# EAGLE design fire alarm (EAGLE 7.4.0)
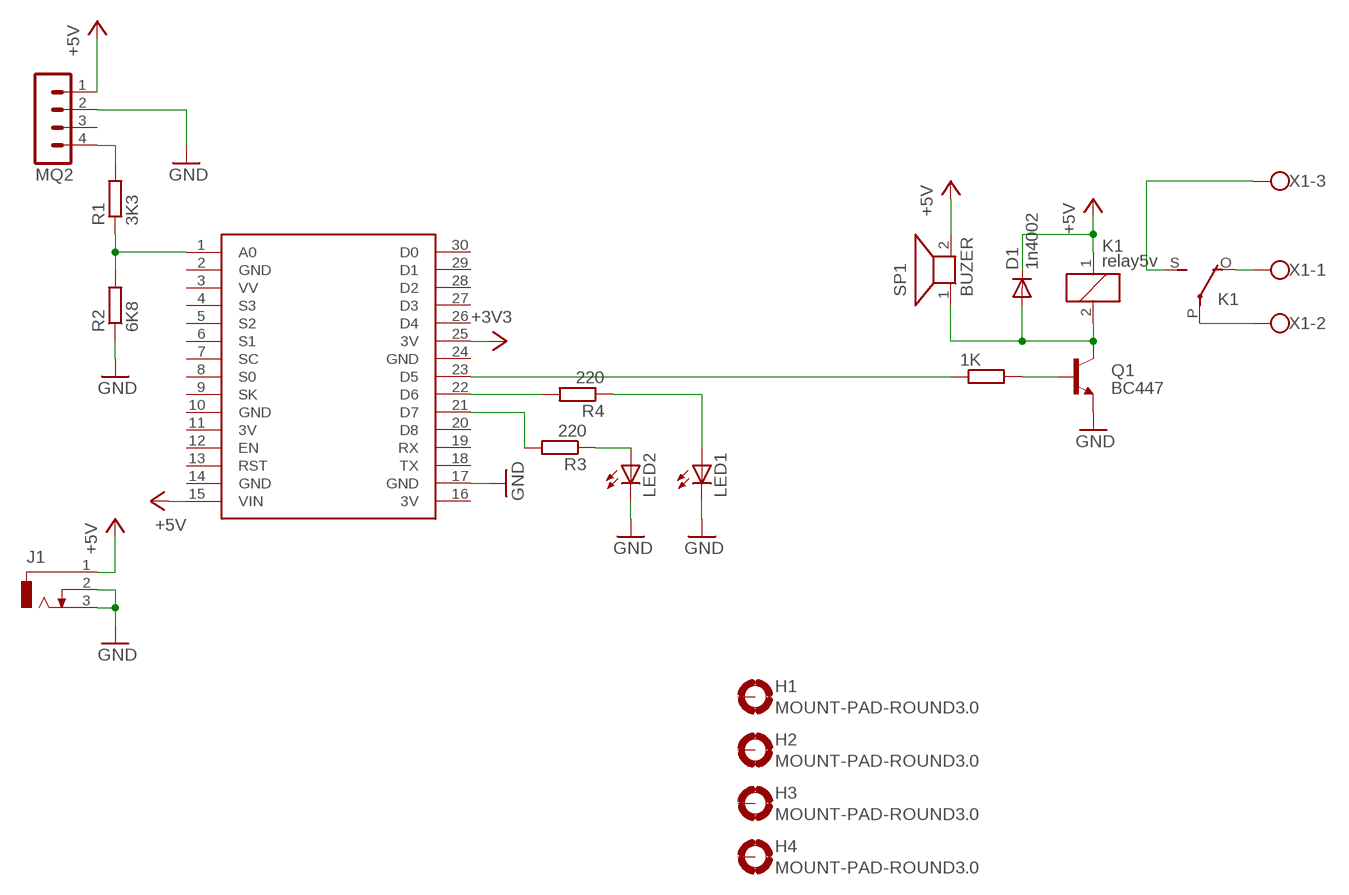
[diagram p0: schematic, sheet 1]

## Parts
1K  R-EU_0207/10  [0207/10]
D1  1n4002  1N4446  [DO35-10]
H1  MOUNT-PAD-ROUND3.0  [3,0-PAD]
H2  MOUNT-PAD-ROUND3.0  [3,0-PAD]
H3  MOUNT-PAD-ROUND3.0  [3,0-PAD]
H4  MOUNT-PAD-ROUND3.0  [3,0-PAD]
J1  DCJ0303  [DCJ0303]
K1  relay5v  ZF112  [ZF112]
LED1  LED5MM  [LED5MM]
LED2  LED5MM  [LED5MM]
MQ2  MA04-1  [MA04-1]
Q1  BC447  [TO92-EBC]
R1  3K3  R-EU_0207/10  [0207/10]
R2  6K8  R-EU_0207/10  [0207/10]
R3  220  R-EU_0207/10  [0207/10]
R4  220  R-EU_0207/10  [0207/10]
SP1  BUZER  AL60P  [AL60P]
U$2  NODEMCU  [NODEMCU]
X1  W237-103  [W237-103]

## Nets
+3V3: U$2.25(3V)
+5V: D1.C J1.1 K1.1 MQ2.1 SP1.2 U$2.15(VIN)
GND: J1.2 J1.3 LED1.K(C) LED2.K(C) MQ2.2 Q1.E R2.1 U$2.17(GND)
N$2: 1K.1 U$2.23(D5)
N$3: R1.1 R2.2 U$2.1(A0)
N$4: MQ2.4 R1.2
N$5: LED2.A R3.1
N$6: LED1.A R4.1
N$7: R4.2 U$2.22(D6)
N$8: R3.2 U$2.21(D7)
N$13: K1.S(2:S) X1.3
N$14: D1.A K1.2 Q1.C SP1.1
N$15: 1K.2 Q1.B
N$20: K1.P(2:P) X1.2
N$21: K1.O(2:O) X1.1
Unconnected: H1.B3,0(MOUNT) H2.B3,0(MOUNT) H3.B3,0(MOUNT) H4.B3,0(MOUNT) MQ2.3 U$2.3(VV) U$2.4(S3) U$2.5(S2) U$2.6(S1) U$2.7(SC) U$2.8(S0) U$2.9(SK) U$2.12(EN) U$2.13(RST) U$2.18(TX) U$2.19(RX) U$2.20(D8) U$2.26(D4) U$2.27(D3) U$2.28(D2) U$2.29(D1) U$2.30(D0)

## Power pins joined to a net without a drawn wire
3V: U$2.11(3V) U$2.16(3V)
GND: U$2.2(GND) U$2.10(GND) U$2.14(GND) U$2.24(GND)

## Library data of the parts
1K R1-R4 = rcl:R-EU_: RESISTOR, European symbol
D1 = diode:1N4446: DIODE high speed (Philips)
H1-H4 = holes:MOUNT-PAD-ROUND: MOUNTING PAD, round
J1 = con-jack:DCJ0303: DC POWER JACK Source: DCJ0303.pdf; OC_FARNELL: unknown; OC_NEWARK: unknown
K1 = relay:ZF112: RELAY 1 x switch; OC_FARNELL: unknown; OC_NEWARK: unknown
LED1 LED2 = led:LED: LED OSRAM: - CHIPLED LG R971, LG N971, LY N971, LG Q971, LY Q971, LO R971, LY R971 LH N974, LH R974 LS Q976, LO Q976, LY Q976 LO Q996 - Hyper CHIPLED LW Q18S LB Q993, LB Q99A, LB R99A - SideLED LS A670, LO A670, LY A670, LG A670, LP A670 LB A673, LV A673, LT A673, LW A673 LH A674 LY A675 LS A676, LA A676, LO A676, LY A676, LW A676 LS A679, LY A679, LG A679 - Hyper Micro SIDELED® LS Y876, LA Y876, LO Y876, LY Y876 LT Y87S - SmartLED LW L88C, LW L88S LB L89C, LB L89S, LG L890 LS L89K, LO L89K, LY L89K LS L896, LA L896, LO L896, LY L896 - TOPLED LS T670, LO T670, LY T670, LG T670, LP T670 LSG T670, LSP T670, LSY T670, LOP T670, LYG T670 LG T671, LOG T671, LSG T671 LB T673, LV T673, LT T673, LW T673 LH T674 LS T676, LA T676, LO T676, LY T676, LB T676, LH T676, LSB T676, LW T676 LB T67C, LV T67C, LT T67C, LS T67K, LO T67K, LY T67K, LW E67C LS E67B, LA E67B, LO E67B, LY E67B, LB E67C, LV E67C, LT E67C LW T67C LS T679, LY T679, LG T679 LS T770, LO T770, LY T770, LG T770, LP T770 LB T773, LV T773, LT T773, LW T773 LH T774 LS E675, LA E675, LY E675, LS T675 LS T776, LA T776, LO T776, LY T776, LB T776 LHGB T686 LT T68C, LB T68C - Hyper Mini TOPLED® LB M676 - Mini TOPLED Santana® LG M470 LS M47K, LO M47K, LY M47K Source: http://www.osram.convergy.de LUXEON: - LUMILED® LXK2-PW12-R00, LXK2-PW12-S00, LXK2-PW14-U00, LXK2-PW14-V00 LXK2-PM12-R00, LXK2-PM12-S00, LXK2-PM14-U00 LXK2-PE12-Q00, LXK2-PE12-R00, LXK2-PE12-S00, LXK2-PE14-T00, LXK2-PE14-U00 LXK2-PB12-K00, LXK2-PB12-L00, LXK2-PB12-M00, LXK2-PB14-N00, LXK2-PB14-P00, LXK2-PB14-Q00 LXK2-PR12-L00, LXK2-PR12-M00, LXK2-PR14-Q00, LXK2-PR14-R00 LXK2-PD12-Q00, LXK2-PD12-R00, LXK2-PD12-S00 LXK2-PH12-R00, LXK2-PH12-S00 LXK2-PL12-P00, LXK2-PL12-Q00, LXK2-PL12-R00 Source: www.luxeon.com KINGBRIGHT: KA-3528ASYC Source: www.kingbright.com
MQ2 = con-lstb:MA04-1: PIN HEADER; OC_FARNELL: unknown; OC_NEWARK: unknown
Q1 = transistor-npn:BC447*: NPN Transistor
SP1 = buzzer:AL60P: SPEAKER Source: Buerklin; OC_FARNELL: unknown; OC_NEWARK: unknown
U$2 = nodemcu:NODEMCU
X1 = con-wago-500:W237-103: WAGO SCREW CLAMP; MPN: 237-103; OC_FARNELL: unknown; OC_NEWARK: 18M7116

## Board
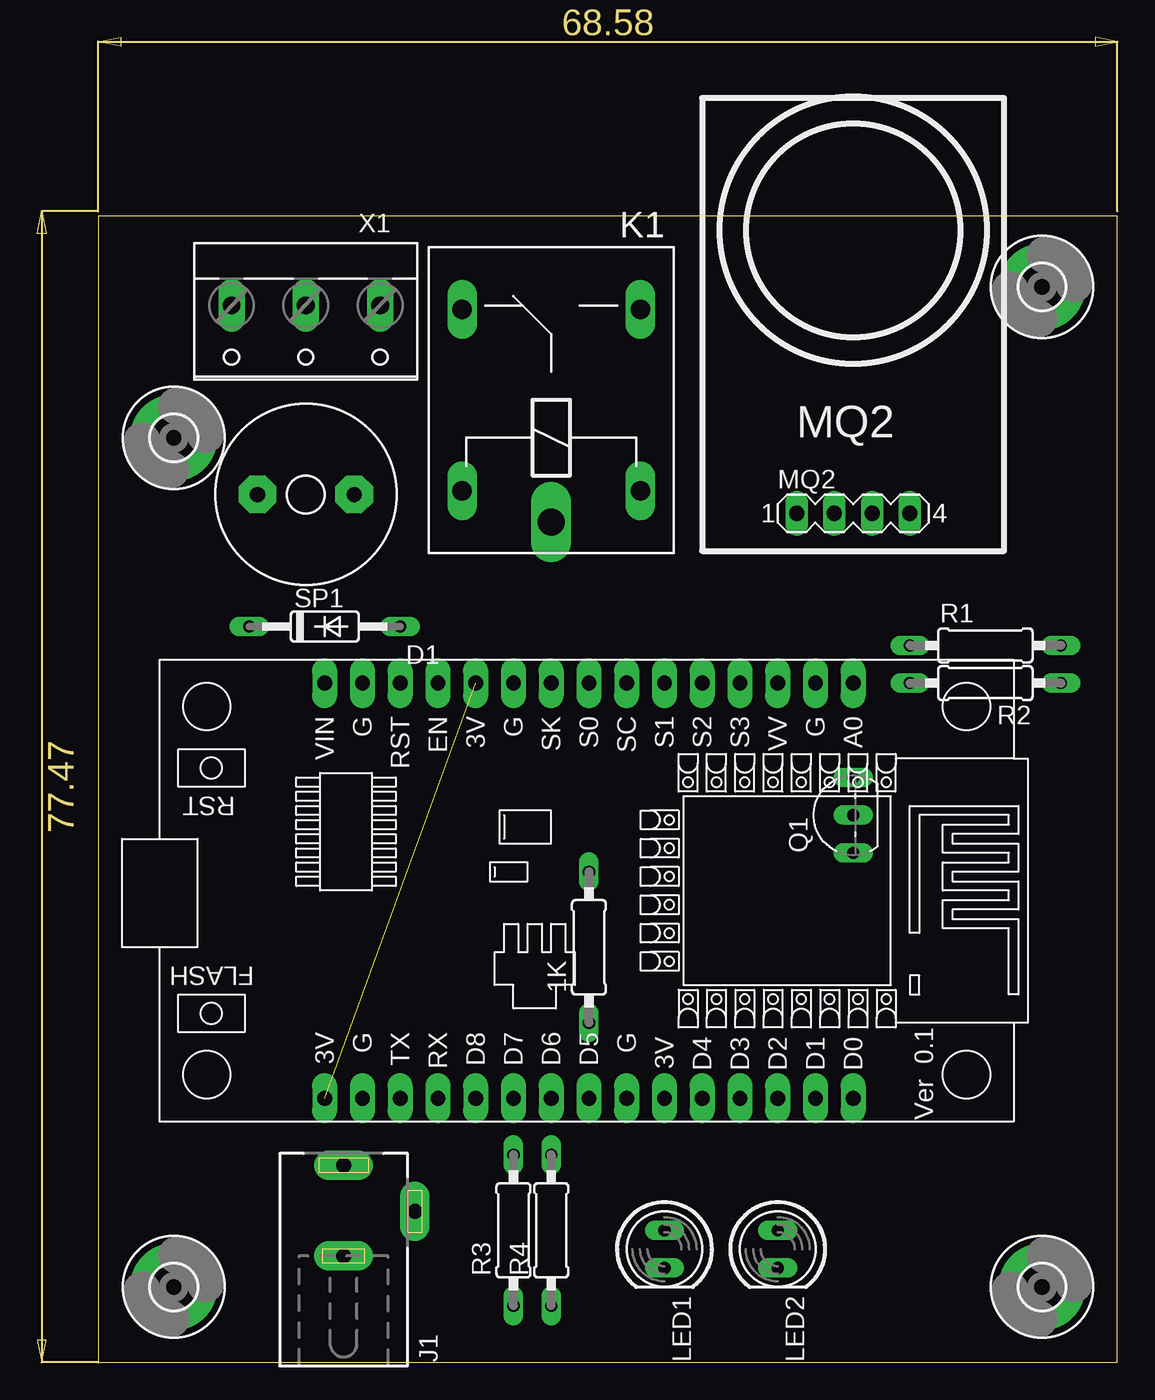
[diagram p1: board, top side]
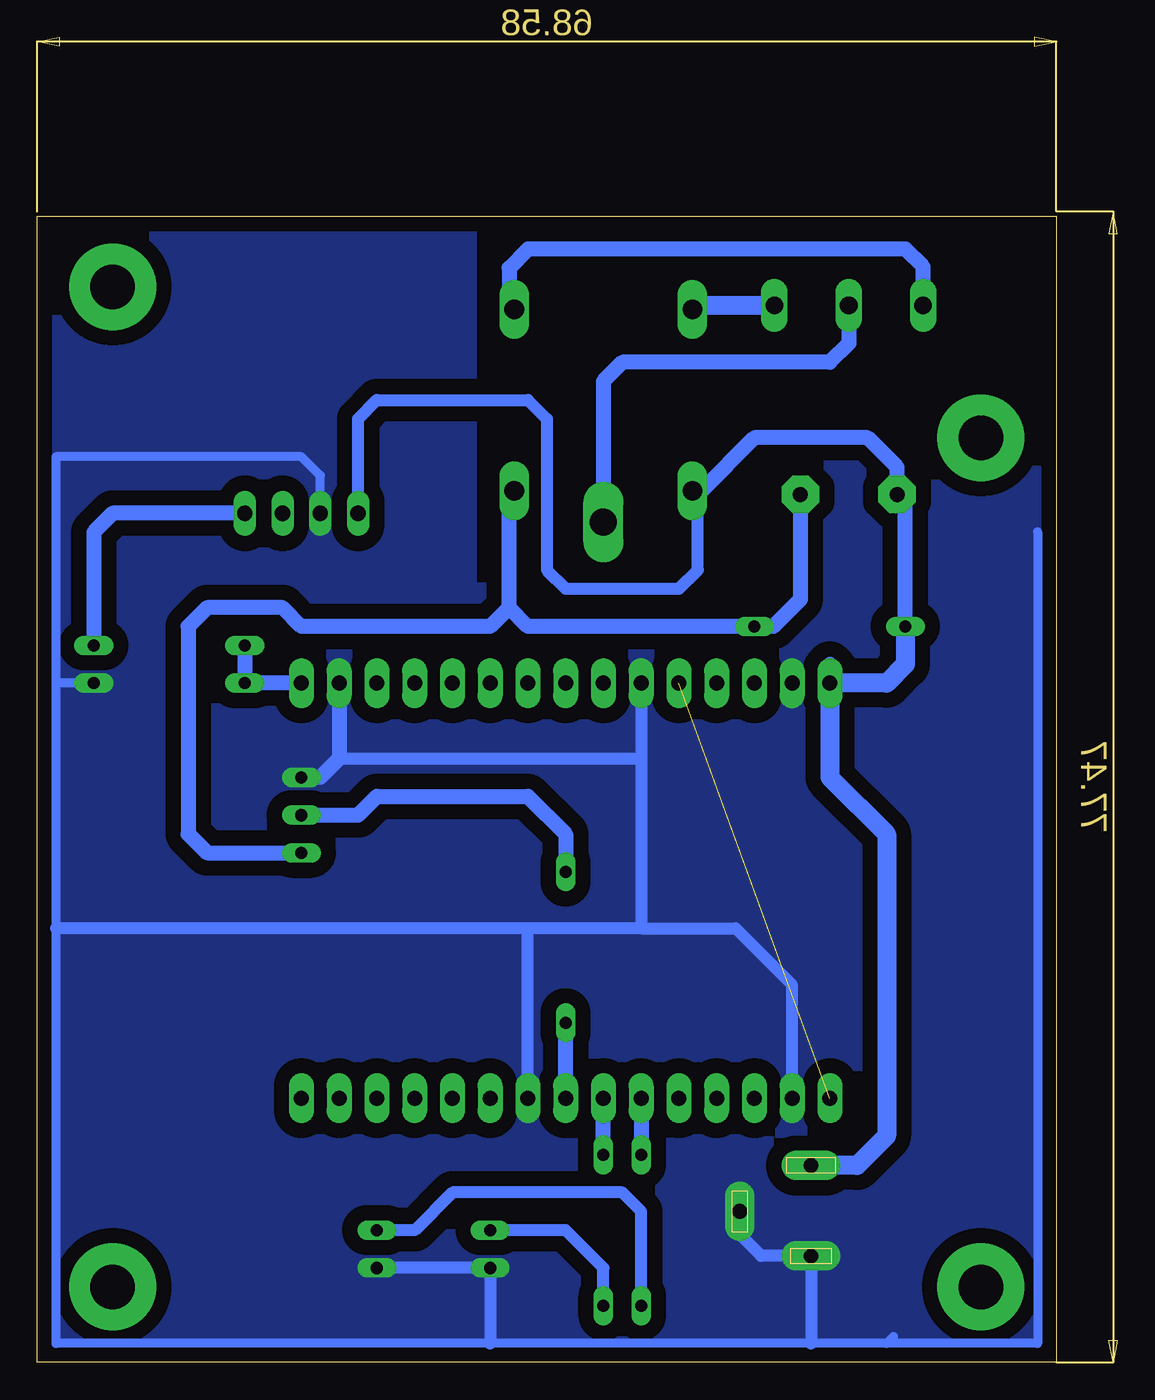
[diagram p2: board, bottom side, seen from below]

Size 68.56 x 77.14 mm. Coordinates in mm from the lower left corner, seen from the top.
Outline: 0,0 68.56,0 68.56,77.14 0,77.14 0,0
Copper layers (1*16): Top 0.035mm / dielectric 1.5mm / Bottom 0.035mm
Design rules "default": minimum track width 10mil, minimum drill 24mil, track to track 8mil, track to pad 8mil, pad to pad 8mil, via to via 8mil, smd to smd 8mil, copper to edge 40mil, drill to drill 8mil, minimum pad ring 10mil, minimum via ring 8mil, stop-mask expansion 4mil, vias tented up to drill 0mil, thermal gap 10mil

### Footprints (pad centres in the part's own frame; a part is rotated, then mirrored left to right if it is on the bottom)
0207/10 = drill 0.813 long: 1 -5.08,0; 2 5.08,0
DO35-10 = drill 0.813 long: A 5.08,0; C -5.08,0
3,0-PAD = drill 3 pad 5.842: B3,0 0,0
DCJ0303 = drill 1 pad 2 long: 1 0,3.1; 2 4.8,0; 3 0,-3
ZF112 = drill 1.321 long: 1 -6.096,5.994; 2 -6.096,-5.994; O 6.096,5.994; S 6.096,-5.994 | drill 1.803 long: P -8.204,0
LED5MM = drill 0.813 long: A -1.27,0; K 1.27,0
MA04-1 = drill 1.016 long: 1 -3.81,0; 2 -1.27,0; 3 1.27,0; 4 3.81,0
TO92-EBC = drill 0.813 long: B 0,-1.27; C -2.54,-1.27; E 2.54,-1.27
AL60P = drill 1.016 pad 2.54 octagon: 1 -3.251,0; 2 3.251,0
NODEMCU = drill 1 pad 1.676 long: 1 -13.97,17.78; 2 -13.97,15.24; 3 -13.97,12.7; 4 -13.97,10.16; 5 -13.97,7.62; 6 -13.97,5.08; 7 -13.97,2.54; 8 -13.97,0; 9 -13.97,-2.54; 10 -13.97,-5.08; 11 -13.97,-7.62; 12 -13.97,-10.16; 13 -13.97,-12.7; 14 -13.97,-15.24; 15 -13.97,-17.78; 16 13.97,-17.78; 17 13.97,-15.24; 18 13.97,-12.7; 19 13.97,-10.16; 20 13.97,-7.62; 21 13.97,-5.08; 22 13.97,-2.54; 23 13.97,0; 24 13.97,2.54; 25 13.97,5.08; 26 13.97,7.62; 27 13.97,10.16; 28 13.97,12.7; 29 13.97,15.24; 30 13.97,17.78
W237-103 = drill 1.194 long: 1 -5,-1.29; 2 0,-1.29; 3 5,-1.29

### Placement (x,y rotation side)
1K  33.02,27.94 90 top
D1  15.24,49.53 0 top
H1  63.5,5.08 0 top
H2  63.5,72.39 0 top
H3  5.08,5.08 0 top
H4  5.08,62.23 0 top
J1  16.51,10.16 0 top
K1  30.48,64.77 90 top
LED1  38.1,7.62 270 top
LED2  45.72,7.62 270 top
MQ2  50.8,57.15 0 top
Q1  49.53,36.83 90 top
R1  59.69,48.26 0 top
R2  59.69,45.72 180 top
R3  27.94,8.89 90 top
R4  30.48,8.89 90 top
SP1  13.97,58.42 180 top
U$2  33.02,31.75 270 top
X1  13.97,69.85 180 top

### Tracks (layer width: path | path; a pad name or v marks a point on that pad's centre or on a via)
3V  (1 unrouted)
+5V
  Bottom 0.813: MQ2.1 46.99,63.5 45.72,64.77 35.56,64.77 34.29,63.5 34.29,53.34 33.02,52.07 25.4,52.07 24.13,53.34 24.13,58.32 K1.1
  Bottom 1.016: U$2.15 15.24,46.99 | D1.C 10.16,57.86 SP1.2 10.72,60.25 12.7,62.23 20.32,62.23 23.88,58.67 K1.1
  Bottom 1.27: J1.1 13.41,13.26 11.43,15.24 11.43,35.56 15.24,39.37 U$2.15 11.43,45.72 10.16,46.99 D1.C
GND
  Bottom 0.61: 1.27,55.9 1.27,1.27 11.43,1.27 | 11.43,1.27 16.51,1.27 38.1,1.27 67.31,1.27 67.31,29.21 67.31,45.72 | 67.31,45.72 67.31,60.96 50.8,60.96 49.53,59.69 MQ2.2 | R2.1 67.31,45.72 | 10.97,1.73 11.43,1.27
  Bottom 0.813: U$2.10 27.94,40.64 | 48.26,40.64 27.94,40.64 | 27.94,40.64 27.94,29.21 | 27.94,29.21 21.59,29.21 17.78,25.4 U$2.17 | LED2.K LED1.K 38.1,1.27 | 16.51,1.27 J1.3 19.86,7.16 21.31,8.61 J1.2 | 27.94,29.21 35.56,29.21 | 35.56,29.21 67.31,29.21 | U$2.24 35.56,29.21
  Bottom 1.016: U$2.2 48.26,40.64 49.53,39.37 Q1.E
  pour Bottom (isolate 1.016, no thermals): 0,0 0,64.77 22.86,64.77 22.86,52.07 39.37,52.07 39.37,77.47 68.58,77.47 68.58,0
N$2
  Bottom 1.016: U$2.23 1K.1
N$3
  Bottom 1.016: U$2.1 R2.2 R1.1
N$4
  Bottom 1.016: MQ2.4 63.5,57.15 64.77,55.88 R1.2
N$5
  Bottom 0.813: R3.1 27.94,10.16 29.21,11.43 40.64,11.43 43.18,8.89 LED2.A
N$6
  Bottom 0.813: R4.1 30.48,6.35 33.02,8.89 LED1.A
N$7
  Bottom 1.016: R4.2 U$2.22
N$8
  Bottom 1.016: U$2.21 R3.2
N$13
  Bottom 1.016: X1.3 8.97,73.74 10.16,74.93 35.56,74.93 36.83,73.66 36.83,71.22 K1.S
N$14
  Bottom 1.016: 36.83,50.8 35.56,49.53 D1.A 19.05,49.53 17.22,51.36 SP1.1 | 36.83,50.8 36.83,58.32 K1.2 | 36.83,50.8 38.1,49.53 50.8,49.53 52.07,50.8 57.15,50.8 58.42,49.53 58.42,35.56 57.15,34.29 Q1.C
N$15
  Bottom 1.016: Q1.B 46.99,36.83 45.72,38.1 35.56,38.1 33.02,35.56 1K.2
N$20
  Bottom 1.016: X1.2 13.97,68.58 15.24,67.31 29.21,67.31 30.48,66.04 K1.P
N$21
  Bottom 1.016: 24.21,71.14 K1.O
  Bottom 1.27: X1.1 24.21,71.14

### Text on the board
tPlace: MQ2